# EAGLE design 4x4-soundboard TH (EAGLE 8.1.0)
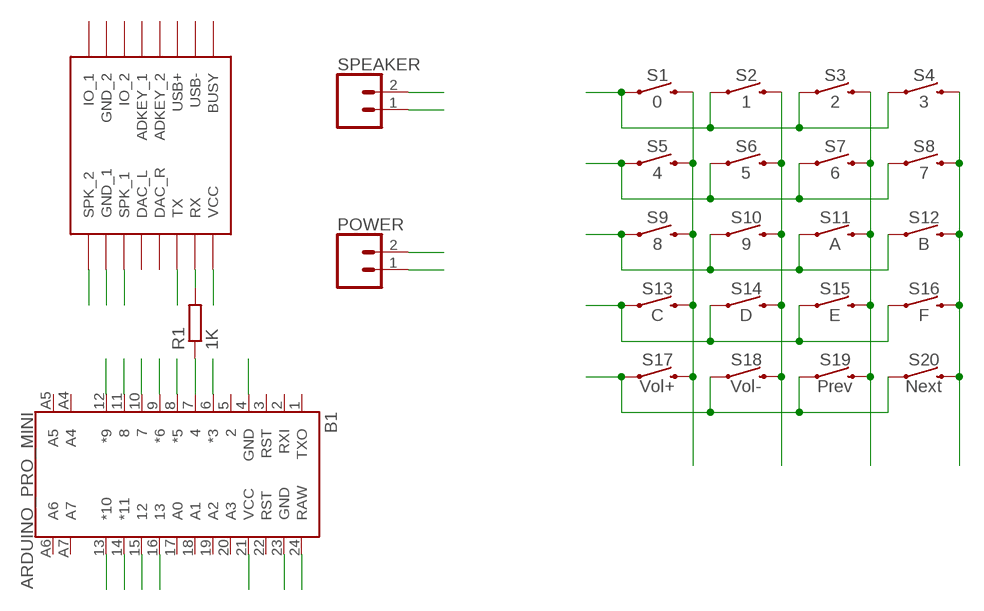
[diagram p0: schematic, sheet 1]

## Parts
B1  ARDUINO_PRO_MINI  [ARDUINO_PRO_MINI]
POWER  CONN_02  [1X02]
R1  1K  R-EU_0207/10  [0207/10]
S1  0  MOMENTARY-SWITCH-SPST-PTH-6.0MM  [TACTILE_SWITCH_PTH_6.0MM]
S2  1  MOMENTARY-SWITCH-SPST-PTH-6.0MM  [TACTILE_SWITCH_PTH_6.0MM]
S3  2  MOMENTARY-SWITCH-SPST-PTH-6.0MM  [TACTILE_SWITCH_PTH_6.0MM]
S4  3  MOMENTARY-SWITCH-SPST-PTH-6.0MM  [TACTILE_SWITCH_PTH_6.0MM]
S5  4  MOMENTARY-SWITCH-SPST-PTH-6.0MM  [TACTILE_SWITCH_PTH_6.0MM]
S6  5  MOMENTARY-SWITCH-SPST-PTH-6.0MM  [TACTILE_SWITCH_PTH_6.0MM]
S7  6  MOMENTARY-SWITCH-SPST-PTH-6.0MM  [TACTILE_SWITCH_PTH_6.0MM]
S8  7  MOMENTARY-SWITCH-SPST-PTH-6.0MM  [TACTILE_SWITCH_PTH_6.0MM]
S9  8  MOMENTARY-SWITCH-SPST-PTH-6.0MM  [TACTILE_SWITCH_PTH_6.0MM]
S10  9  MOMENTARY-SWITCH-SPST-PTH-6.0MM  [TACTILE_SWITCH_PTH_6.0MM]
S11  A  MOMENTARY-SWITCH-SPST-PTH-6.0MM  [TACTILE_SWITCH_PTH_6.0MM]
S12  B  MOMENTARY-SWITCH-SPST-PTH-6.0MM  [TACTILE_SWITCH_PTH_6.0MM]
S13  C  MOMENTARY-SWITCH-SPST-PTH-6.0MM  [TACTILE_SWITCH_PTH_6.0MM]
S14  D  MOMENTARY-SWITCH-SPST-PTH-6.0MM  [TACTILE_SWITCH_PTH_6.0MM]
S15  E  MOMENTARY-SWITCH-SPST-PTH-6.0MM  [TACTILE_SWITCH_PTH_6.0MM]
S16  F  MOMENTARY-SWITCH-SPST-PTH-6.0MM  [TACTILE_SWITCH_PTH_6.0MM]
S17  Vol+  MOMENTARY-SWITCH-SPST-PTH-6.0MM  [TACTILE_SWITCH_PTH_6.0MM]
S18  Vol-  MOMENTARY-SWITCH-SPST-PTH-6.0MM  [TACTILE_SWITCH_PTH_6.0MM]
S19  Prev  MOMENTARY-SWITCH-SPST-PTH-6.0MM  [TACTILE_SWITCH_PTH_6.0MM]
S20  Next  MOMENTARY-SWITCH-SPST-PTH-6.0MM  [TACTILE_SWITCH_PTH_6.0MM]
SPEAKER  CONN_02  [1X02]
U$1  DFPLAYER  [DFPLAYER]

## Nets
5V: B1.21(VCC) U$1.VCC
COL1: B1.13(*10) S1.3 S5.3 S9.3 S13.3 S17.3
COL2: B1.14(*11) S2.3 S6.3 S10.3 S14.3 S18.3
COL3: B1.15 S3.3 S7.3 S11.3 S15.3 S19.3
COL4: B1.16 S4.3 S8.3 S12.3 S16.3 S20.3
GND: B1.4(GND) B1.23(GND) POWER.2 U$1.GND_1
N$1: B1.7 R1.1
ROW1: B1.8(*5) S1.1 S2.1 S3.1 S4.1
ROW2: B1.9(*6) S5.1 S6.1 S7.1 S8.1
ROW3: B1.10 S9.1 S10.1 S11.1 S12.1
ROW4: B1.11 S13.1 S14.1 S15.1 S16.1
ROW5: B1.12(*9) S17.1 S18.1 S19.1 S20.1
SPK+: SPEAKER.1 U$1.SPK1(SPK_1)
SPK-: SPEAKER.2 U$1.SPK2(SPK_2)
SRX: B1.6(*3) U$1.TX
STX: R1.2 U$1.RX
VIN: B1.24(RAW) POWER.1
Unconnected: B1.1(TXO) B1.2(RXI) B1.3(RST) B1.5 B1.17(A0) B1.18(A1) B1.19(A2) B1.20(A3) B1.22(RST) B1.A4 B1.A5 B1.A6 B1.A7 U$1.ADKEY1(ADKEY_1) U$1.ADKEY2(ADKEY_2) U$1.BUSY U$1.DAC_L U$1.DAC_R U$1.GND_2 U$1.IO1(IO_1) U$1.IO2(IO_2) U$1.USB+ U$1.USB-

## Library data of the parts
B1 = SparkFun-Boards:ARDUINO_PRO_MINI: SparkFun Pro Mini Pro Mini compatible footprint. Dimensions: 0.7 x 1.3" PCB Thickness: 0.8mm SparkFun Products: 3.3V/8MHz <https://www.sparkfun.com/products/11114> 5V/16MHz <https://www.sparkfun.com/products/11113>
POWER SPEAKER = SparkFun-Connectors:CONN_02: Multi connection point. Often used as Generic Header-pin footprint for 0.1 inch spaced/style header connections On any of the 0.1 inch spaced packages, you can populate with these: Break Away Headers - Straight <https://www.sparkfun.com/products/116> (PRT-00116) Break Away Male Headers - Right Angle <https://www.sparkfun.com/products/553> (PRT-00553) Female Headers <https://www.sparkfun.com/products/115> (PRT-00115) Break Away Headers - Machine Pin <https://www.sparkfun.com/products/117> (PRT-00117) Break Away Female Headers - Swiss Machine Pin <https://www.sparkfun.com/products/743> (PRT-00743) For SCREWTERMINALS and SPRING TERMINALS visit here: Screw Terimnals on SparkFun.com <https://www.sparkfun.com/search/results?term=Screw+Terminals> (5mm/3.5mm/2.54mm spacing) This device is also useful as a general connection point to wire up your design to another part of your project. Our various solder wires solder well into these plated through hole pads. Hook-Up Wire - Assortment (Stranded, 22 AWG) <https://www.sparkfun.com/products/11375> (PRT-11375) Hook-Up Wire - Assortment (Solid Core, 22 AWG) <https://www.sparkfun.com/products/11367> (PRT-11367) View the entire wire category on our website here <https://www.sparkfun.com/categories/141> Special notes: Molex polarized connector foot print use with: PRT-08233 with associated crimp pins and housings. 2.54_SCREWTERM for use with PRT-10571. 3.5mm Screw Terminal footprints for PRT-08084 5mm Screw Terminal footprints for use with PRT-08432
R1 = resistor:R-EU_: RESISTOR, European symbol
S1-S20 = SparkFun-Switches:MOMENTARY-SWITCH-SPST: Momentary Switch (Pushbutton) - SPST Normally-open (NO) SPST momentary switches (buttons, pushbuttons). Variants PTH-12MM - 12mm square, through-hole Momentary Pushbutton Switch - 12mm Square <https://www.sparkfun.com/products/9190> (COM-09190) PTH-6.0MM, PTH-6.0MM-KIT - 6.0mm square, through-hole Mini Pushbutton Switch <https://www.sparkfun.com/products/97> (COM-00097) KIT package intended for soldering kit's - only one side of pads' copper is exposed. PTH-RIGHT-ANGLE-KIT - Right-angle, through-hole Right Angle Tactile Button <https://www.sparkfun.com/products/10791> - Used on SparkFun BigTime Watch Kit <https://www.sparkfun.com/products/11734> SMD-12MM - 12mm square, surface-mount Tactile Button - SMD (12mm) <https://www.sparkfun.com/products/12993> (COM-12993) Used on SparkFun PicoBoard <https://www.sparkfun.com/products/11888> SMD-4.5MM - 4.5mm Square Trackball Switch Used on SparkFun Blackberry Trackballer Breakout <https://www.sparkfun.com/products/13169> SMD-4.6MMX2.8MM - 4.60mm x 2.80mm, surface mount Used on SparkFun SAMD21 Mini Breakout <https://www.sparkfun.com/products/13664> SMD-5.2MM, SMD-5.2-REDUNDANT - 5.2mm square, surface-mount Mini Pushbutton Switch - SMD <https://www.sparkfun.com/products/8720> (COM-08720) Used on Arduino Pro Mini <https://www.sparkfun.com/products/11114> REDUNDANT package connects both switch circuits together SMD-6.0X3.5MM - 6.0 x 3.5mm, surface mount Momentary Reset Switch SMD <https://www.sparkfun.com/products/8229> (COM-08229) SMD-6.2MM-TALL - 6.2mm square, surface mount Tactile Button - SMD (6mm) <https://www.sparkfun.com/products/12992> Used on SparkFun Digital Sandbox <https://www.sparkfun.com/products/12651> SMD-RIGHT-ANGLE - Right-angle, surface mount Used on SparkFun Block for Intel® Edison - Arduino <https://www.sparkfun.com/products/13036>; PROD_ID: SWCH-08441; SF_SKU: COM-00097
U$1 = DFPlayer_v1:DFPLAYER

## Board
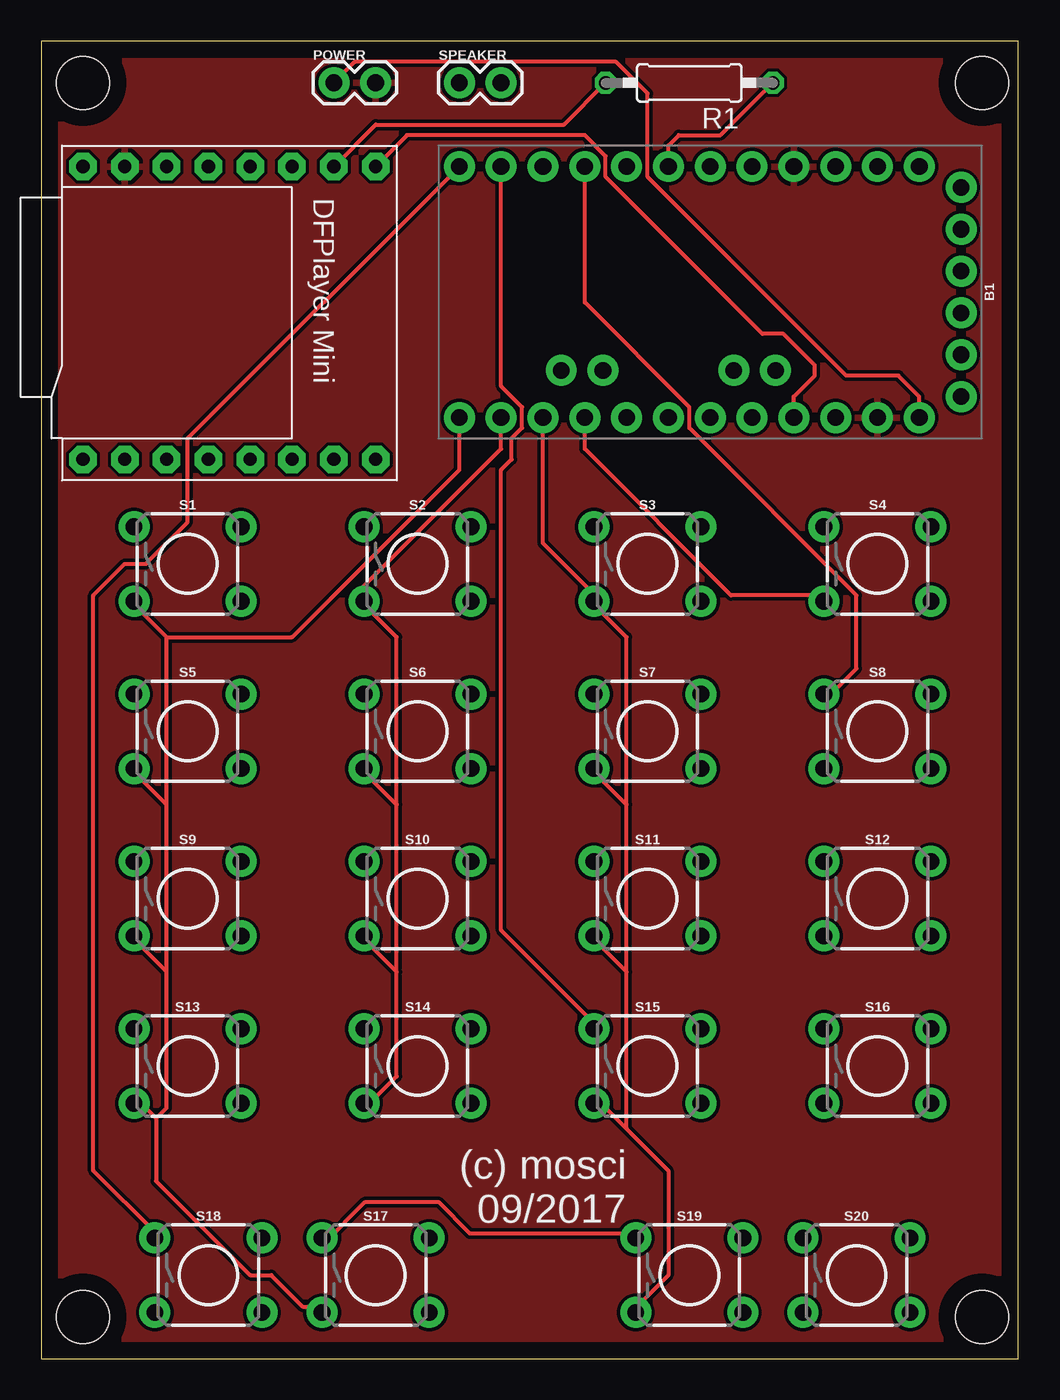
[diagram p1: board, top side]
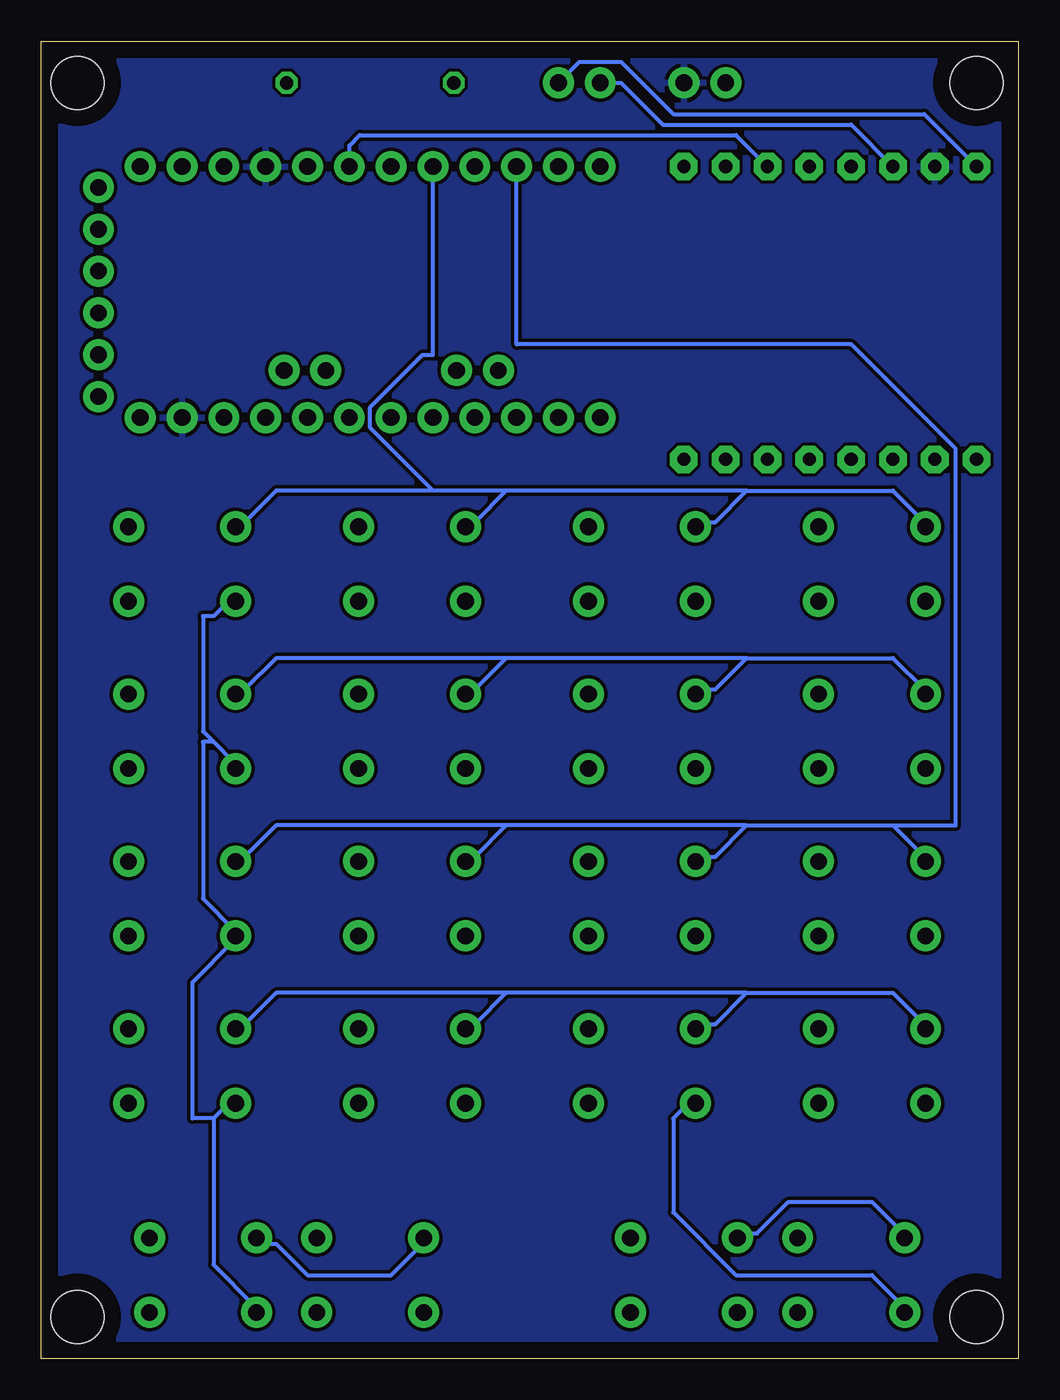
[diagram p2: board, bottom side, seen from below]

Size 59.36 x 80 mm. Coordinates in mm from the lower left corner, seen from the top.
Outline: 0,0 59.36,0 59.36,80 0,80 0,0
Copper layers (1*16): Top 0.035mm / dielectric 1.5mm / Bottom 0.035mm
Design rules "default": minimum track width 10mil, minimum drill 24mil, track to track 8mil, track to pad 8mil, pad to pad 8mil, via to via 8mil, smd to smd 8mil, copper to edge 40mil, drill to drill 8mil, minimum pad ring 10mil, minimum via ring 8mil, stop-mask expansion 4mil, vias tented up to drill 0mil, thermal gap 10mil
Holes 3.2 mm at 2.54,77.47 57.15,77.47 2.54,2.54 57.15,2.54

### Footprints (pad centres in the part's own frame; a part is rotated, then mirrored left to right if it is on the bottom)
ARDUINO_PRO_MINI = drill 1.016 pad 1.88: 1 -7.62,12.7; 2 -7.62,10.16; 3 -7.62,7.62; 4 -7.62,5.08; 5 -7.62,2.54; 6 -7.62,0; 7 -7.62,-2.54; 8 -7.62,-5.08; 9 -7.62,-7.62; 10 -7.62,-10.16; 11 -7.62,-12.7; 12 -7.62,-15.24; 13 7.62,-15.24; 14 7.62,-12.7; 15 7.62,-10.16; 16 7.62,-7.62; 17 7.62,-5.08; 18 7.62,-2.54; 19 7.62,0; 20 7.62,2.54; 21 7.62,5.08; 22 7.62,7.62; 23 7.62,10.16; 24 7.62,12.7; A4 4.763,1.429; A5 4.763,3.969; A6 4.763,-9.049; A7 4.763,-6.509; BLK -6.35,15.24; GND -3.81,15.24; GRN 6.35,15.24; RXI 1.27,15.24; TXO 3.81,15.24; VCC -1.27,15.24
1X02 = drill 1.016 pad 1.88: 1 0,0; 2 2.54,0
0207/10 = drill 0.813 octagon: 1 -5.08,0; 2 5.08,0
TACTILE_SWITCH_PTH_6.0MM = drill 1.016 pad 1.88: 1 -3.251,2.261; 2 3.251,2.261; 3 -3.251,-2.261; 4 3.251,-2.261
DFPLAYER = drill 0.8 pad 1.676 octagon: ADKEY1 8.89,-1.27; ADKEY2 8.89,1.27; BUSY 8.89,8.89; DAC_L -8.89,-1.27; DAC_R -8.89,1.27; GND_1 -8.89,-6.35; GND_2 8.89,-6.35; IO1 8.89,-8.89; IO2 8.89,-3.81; RX -8.89,6.35; SPK1 -8.89,-3.81; SPK2 -8.89,-8.89; TX -8.89,3.81; USB+ 8.89,3.81; USB- 8.89,6.35; VCC -8.89,8.89

### Placement (x,y rotation side)
B1  40.64,64.77 270 top
POWER  17.78,77.47 0 top
R1  39.37,77.47 180 top
S1  8.89,48.26 0 top
S2  22.86,48.26 0 top
S3  36.83,48.26 0 top
S4  50.8,48.26 0 top
S5  8.89,38.1 0 top
S6  22.86,38.1 0 top
S7  36.83,38.1 0 top
S8  50.8,38.1 0 top
S9  8.89,27.94 0 top
S10  22.86,27.94 0 top
S11  36.83,27.94 0 top
S12  50.8,27.94 0 top
S13  8.89,17.78 0 top
S14  22.86,17.78 0 top
S15  36.83,17.78 0 top
S16  50.8,17.78 0 top
S17  20.32,5.08 0 top
S18  10.16,5.08 0 top
S19  39.37,5.08 0 top
S20  49.53,5.08 0 top
SPEAKER  25.4,77.47 0 top
U$1  11.43,63.5 270 top

### Tracks (layer width: path | path; a pad name or v marks a point on that pad's centre or on a via)
5V
  Top 0.254: U$1.VCC 22.23,74.3 33.02,74.3 34.29,73.03 34.29,71.75 43.81,62.23 45.09,62.23 46.99,60.33 46.99,59.69 45.72,58.42 B1.21
COL1
  Top 0.254: 6.99,14.61 6.99,10.79 12.7,5.08 13.97,5.08 15.88,3.17 16.51,3.17 S17.3 | 6.99,14.61 5.71,15.88 S13.3 | 7.62,23.5 5.71,25.4 S9.3 | 7.62,23.5 7.62,15.24 6.99,14.61 | 7.62,33.66 5.71,35.56 S5.3 | 7.62,23.5 7.62,33.66 | 7.62,43.81 5.71,45.72 S1.3 | 7.62,33.66 7.62,43.81 | B1.13 25.4,53.98 15.24,43.81 7.62,43.81
COL2
  Top 0.254: 21.59,23.5 19.68,25.4 S10.3 | 21.59,23.5 21.59,17.14 19.68,15.24 S14.3 | 21.59,33.66 19.68,35.56 S6.3 | 21.59,23.5 21.59,33.66 | 21.59,33.66 21.59,43.81 19.68,45.72 S2.3 19.05,46.35 27.94,55.24 B1.14
  Bottom 0.254: S18.3 6.99,3.17 8.89,5.08 17.14,5.08 20.95,8.89 20.95,14.61 20.32,15.24 19.68,15.24 S14.3
COL3
  Top 0.254: 35.56,13.97 33.66,15.88 S15.3 | 35.56,13.97 38.1,11.43 38.1,5.08 36.2,3.17 S19.3 | 35.56,23.5 33.66,25.4 S11.3 | 35.56,13.97 35.56,23.5 | 35.56,33.66 33.66,35.56 S7.3 | 35.56,23.5 35.56,33.66 | 35.56,33.66 35.56,43.81 33.66,45.72 S3.3 33.66,46.35 30.48,49.53 B1.15
COL4
  Top 0.254: B1.16 33.02,55.24 41.91,46.35 46.99,46.35 S4.3
  Bottom 0.254: 48.9,14.61 48.9,5.71 46.35,3.17 S20.3 | 48.9,14.61 48.26,15.24 47.62,15.24 S16.3 | 48.9,14.61 50.16,14.61 50.16,22.86 47.62,25.4 S12.3 47.62,26.04 49.53,27.94 49.53,37.47 48.9,37.47 | 48.9,37.47 49.53,38.1 49.53,45.09 48.9,45.09 48.26,45.72 47.62,45.72 S4.3 | 48.9,37.47 47.62,36.2 S8.3
GND
  pour Top: -13.97,88.9 78.74,88.9 78.74,-20.32 -13.97,-20.32
  pour Bottom: -7.62,85.09 69.85,85.09 69.85,83.82 69.85,-11.43 -7.62,-11.43
N$1
  Top 0.254: R1.1 41.27,74.3 38.73,74.3 38.1,73.66 B1.7
ROW1
  Bottom 0.254: 16.51,52.7 7.62,52.7 5.71,50.8 S1.1 | 16.51,52.7 18.41,50.8 19.05,50.8 S2.1 | 31.11,52.7 33.02,50.8 S3.1 | 16.51,52.7 31.11,52.7 | 31.11,52.7 35.56,52.7 | 35.56,52.7 45.09,52.7 46.99,50.8 S4.1 | B1.8 35.56,60.96 36.2,60.96 39.37,57.78 39.37,56.52 35.56,52.7
ROW2
  Top 0.254: B1.9 33.02,64.14 39.37,57.78 39.37,56.52 49.53,46.35 49.53,41.91 47.62,40.01 S8.1
  Bottom 0.254: 16.51,42.55 7.62,42.55 5.71,40.64 S5.1 | 16.51,42.55 18.41,40.64 19.05,40.64 S6.1 | 31.11,42.55 33.02,40.64 S7.1 | 16.51,42.55 31.11,42.55 | 31.11,42.55 45.09,42.55 46.99,40.64 S8.1
ROW3
  Bottom 0.254: 7.62,32.38 5.71,30.48 S9.1 | 16.51,32.38 7.62,32.38 | 16.51,32.38 18.41,30.48 19.05,30.48 S10.1 | 31.11,32.38 33.02,30.48 S11.1 | 16.51,32.38 31.11,32.38 | 31.11,32.38 45.09,32.38 46.99,30.48 S12.1 | B1.10 30.48,61.59 10.16,61.59 3.81,55.24 3.81,32.38 7.62,32.38
ROW4
  Top 0.254: B1.11 27.94,59.05 29.21,57.78 29.21,56.52 28.57,55.88 28.57,54.61 27.94,53.98 27.94,26.04 33.66,20.32 S15.1
  Bottom 0.254: 16.51,22.23 7.62,22.23 5.71,20.32 S13.1 | 16.51,22.23 18.41,20.32 19.05,20.32 S14.1 | 31.11,22.23 33.02,20.32 S15.1 | 16.51,22.23 31.11,22.23 | 31.11,22.23 45.09,22.23 46.99,20.32 S16.1
ROW5
  Top 0.254: B1.12 8.89,55.88 8.89,50.8 6.35,48.26 5.08,48.26 3.17,46.35 3.17,11.43 6.99,7.62 S18.1 | S19.1 35.56,7.62 26.04,7.62 24.13,9.53 19.68,9.53 17.14,6.99 S17.1
  Bottom 0.254: S19.1 36.2,6.99 38.1,5.08 43.18,5.08 45.09,6.99 45.72,6.99 S20.1 | S18.1 6.99,7.62 8.89,9.53 13.97,9.53 15.88,7.62 16.51,7.62 S17.1
SPK+
  Bottom 0.254: U$1.SPK1 10.16,74.93 21.59,74.93 24.13,77.47 SPEAKER.1
SPK-
  Bottom 0.254: U$1.SPK2 5.71,75.56 20.95,75.56 24.13,78.74 26.67,78.74 SPEAKER.2
SRX
  Bottom 0.254: U$1.TX 17.14,74.3 40.01,74.3 40.64,73.66 B1.6
STX
  Top 0.254: R1.2 31.75,74.93 20.32,74.93 U$1.RX
VIN
  Top 0.254: POWER.1 19.05,78.74 34.92,78.74 36.83,76.83 36.83,71.75 48.9,59.69 52.07,59.69 53.34,58.42 B1.24

### Text on the board
tNames: (c) mosci / 09/2017